# Altium schematic sheet IdealDiode.SchDoc
size A4; SheetNumber: 4; SheetTotal: 4
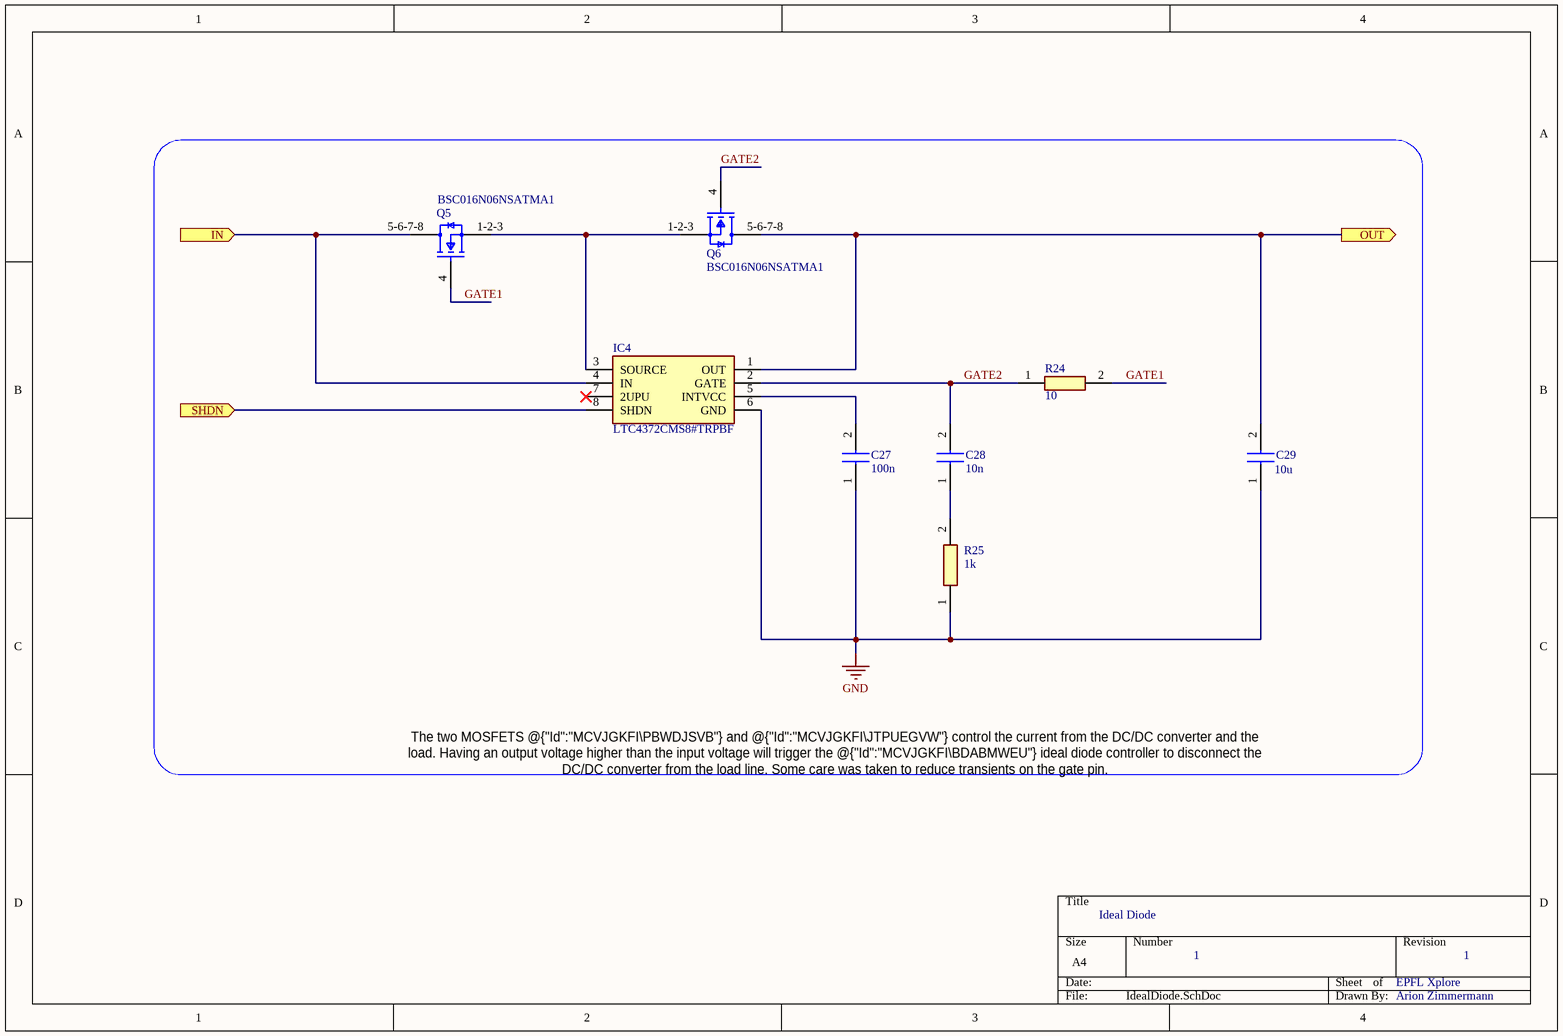
[diagram p0: IdealDiode.SchDoc]

## Parts
C27  value 100n  [CAPC1608X95N]  (hidden comment: C0603C104K5RACTU)
C28  value 10n  [CAPC1608X95N]  (hidden comment: C0603C103K5RACTU)
C29  value 10u  [CAPC3225X230N]  (hidden comment: C3225X7R2A106K250AC)
IC4  LTC4372CMS8#TRPBF  [SOP65P490X110-8N]
Q5  BSC016N06NSATMA1  [FP-PG-TDSON-8-MFG]
Q6  BSC016N06NSATMA1  [FP-PG-TDSON-8-MFG]
R24  value 10  [RESC1608X55N]  (hidden comment: CRCW060310R0JNEAC)
R25  value 1k  [RESC1608X55N]  (hidden comment: CRCW06031K00FKECC)

## Ports
IN (in), OUT (out), SHDN (in)

## Nets
GND: C27.1 C29.1 IC4.6(GND) R25.1
GATE1: Q5.4(G) R24.2
GATE2: C28.2 IC4.2(GATE) Q6.4(G) R24.1
IN: IC4.4(IN) Q5.5-6-7-8(D) ; port IN
OUT: C29.2 IC4.1(OUT) Q6.5-6-7-8(D) ; port OUT
SHDN: IC4.8(SHDN) ; port SHDN
NetC27_2: C27.2 IC4.5(INTVCC)
NetC28_1: C28.1 R25.2
NetIC4_3: IC4.3(SOURCE) Q5.1-2-3(S) Q6.1-2-3(S)

Not connected (* = marked no-connect by the designer): IC4 7(2UPU)*

## Notes on the sheet
- The two MOSFETS @{"Id":"MCVJGKFI\PBWDJSVB"} and @{"Id":"MCVJGKFI\JTPUEGVW"} control the current from the DC/DC converter and the load. Having an output voltage higher than the input voltage will trigger the @{"Id":"MCVJGKFI\BDABMWEU"} ideal diode controller to disconnect the DC/DC converter from the load line. Some care was taken to reduce transients on the gate pin.
- Ideal Diode
- 1
- EPFL Xplore
- Arion Zimmermann

## Library data of the parts
C27 C28 = C0603C104K5RACTU: Capacitor; Manufacturer_Name: Kemet; Datasheet Link: http://www.farnell.com/datasheets/2205446.pdf; Height: 0.95mm; Manufacturer_Part_Number: C0603C104K5RACTU; Mouser Part Number: 80-C0603C104K5R; Mouser Price/Stock: https://www.mouser.co.uk/ProductDetail/KEMET/C0603C104K5RACTU?qs=l5k%252BbMnNDkkVcnZPSAaaiQ%3D%3D; Arrow Part Number: C0603C104K5RACTU; Arrow Price/Stock: https://www.arrow.com/en/products/c0603c104k5ractu/kemet-corporation; Supplier 1: Mouser; Supplier Part Number 1: 80-C0603C104K5R
C29 = C3225X7R2A106K250AC: Capacitor; Manufacturer_Name: TDK; Datasheet Link: https://product.tdk.com/info/en/catalog/datasheets/mlcc_commercial_midvoltage_en.pdf; Height: 2.3mm; Manufacturer_Part_Number: C3225X7R2A106K250AC; Mouser Part Number: 810-C3225X7R2A106K25; Mouser Price/Stock: https://www.mouser.co.uk/ProductDetail/TDK/C3225X7R2A106K250AC?qs=rSMjJ%252B1ewcQNu1nTZev8UA%3D%3D
IC4 = LTC4372CMS8#TRPBF: Integrated Circuit; Manufacturer_Name: Analog Devices; Datasheet Link: https://www.arrow.com/en/products/ltc4372cms8trpbf/analog-devices; Height: 1.1mm; Manufacturer_Part_Number: LTC4372CMS8#TRPBF; Mouser Part Number: 584-LTC4372CMS8TRPBF; Mouser Price/Stock: https://www.mouser.co.uk/ProductDetail/Analog-Devices/LTC4372CMS8TRPBF?qs=T94vaHKWudSmRk6S7wUTVw%3D%3D; Arrow Part Number: LTC4372CMS8#TRPBF; Arrow Price/Stock: https://www.arrow.com/en/products/ltc4372cms8trpbf/analog-devices; Supplier 1: Mouser; Supplier Part Number 1: 584-LTC4372CMS8TRPBF
Q5 Q6 = CMP-32901-000166-1: MOSFET N-CH 60V 30A TDSON-8; Manufacturer: Infineon; Reverse Recovery Charge: 78nC; Power Dissipation: 2.5W; Transconductance: 140S; Gate Charge At Vgs: 71nC @ 10V; Turn On Delay Time: 19ns; Number Of Channels: 1; Typ Forward Diode Voltage: 0.9V; Depletion Mode: False; Max Forward Diode Voltage: 1.2V; Reverse Recovery Time: 61ns; Input Capacitace At Vds: 5200pF @ 30V; Gate To Source Voltage: 20V; Threshold Vgs Min: 2.1V; Drain To Source Resistance: 1.4mΩ; Turn Off Delay Time: 35ns; Threshold Vgs Max: 3.3V; Pulse Drain Current: 400A; Rthja Max: 50K/W; Max Junction Temp: +150°C; Temperature Range High: +150°C; Lead Free: Yes; ComponentLink2URL: https://www.infineon.com/dgdl/Infineon-BSC016N06NS-DS-v02_01-en.pdf?fileId=db3a3043353fdc160135532b353c483c; Device Class L2: Transistors; Drain To Source Voltage: 60V; ComponentLink2Description: Datasheet; Device Class L1: Discrete Semiconductors; Drain To Source Breakdown Voltage: 60V; Manufacturer Part Number: BSC016N06NSATMA1; Continuous Drain Current: 30A; Package: PG-TDSON-8; Octopart: https://octopart.com/bsc016n06nsatma1-infineon-23421881; Automotive: No; Temperature Range Low: -55°C; Footprint Url: https://www.infineon.com/cms/en/product/packages/PG-TDSON/PG-TDSON-8-17/; RoHS: TRUE; Number Of N Channels: 1; Temperature: -55°C to +150°C; Height: 1.1mm; Device Class L3: MOSFETs; Category: Trans; Digikey Description: MOSFET N-CH 60V 30A TDSON-8
R24 R25 = CRCW0603100RFKEBC: Resistor; Manufacturer_Name: Vishay; Datasheet Link: https://www.vishay.com/docs/28773/crcwce3.pdf; Height: 0.55mm; Manufacturer_Part_Number: CRCW0603100RFKEBC; Mouser Part Number: 71-CRCW0603100RFKEBC; Mouser Price/Stock: https://www.mouser.co.uk/ProductDetail/Vishay-Dale/CRCW0603100RFKEBC?qs=wd5RIQLrsJhdvQFtBw4oWg%3D%3D; Arrow Part Number: CRCW0603100RFKEBC; Arrow Price/Stock: https://www.arrow.com/en/products/crcw0603100rfkebc/vishay?region=nac